# EasyEDA Pro project ProPrj_智能视觉集成板-V1.1.epro, board PCB1
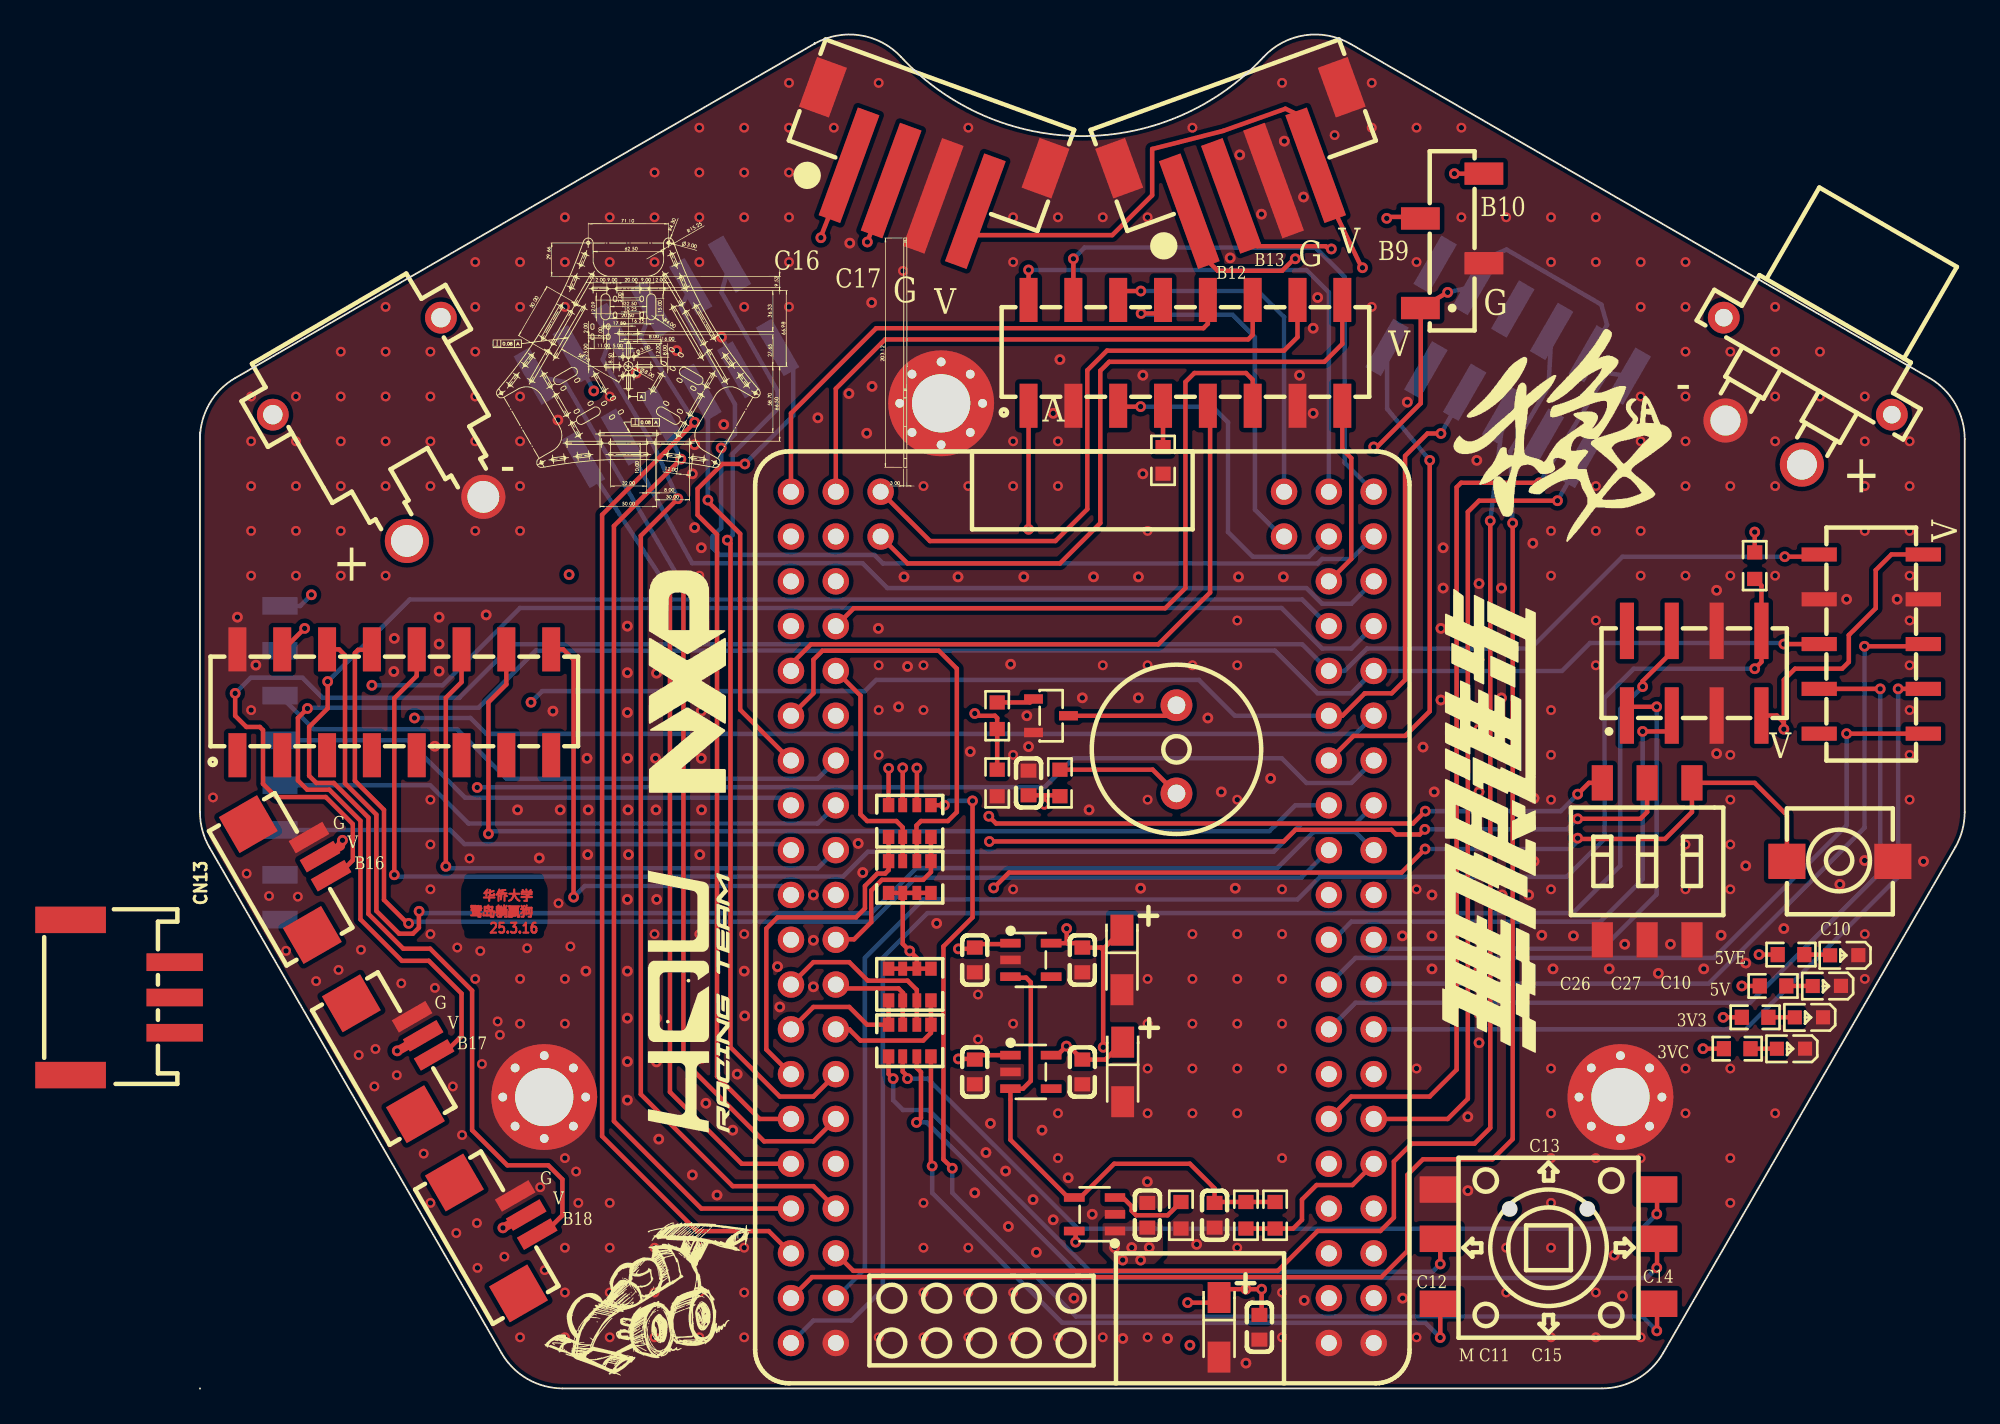
[diagram p11: board, top side]
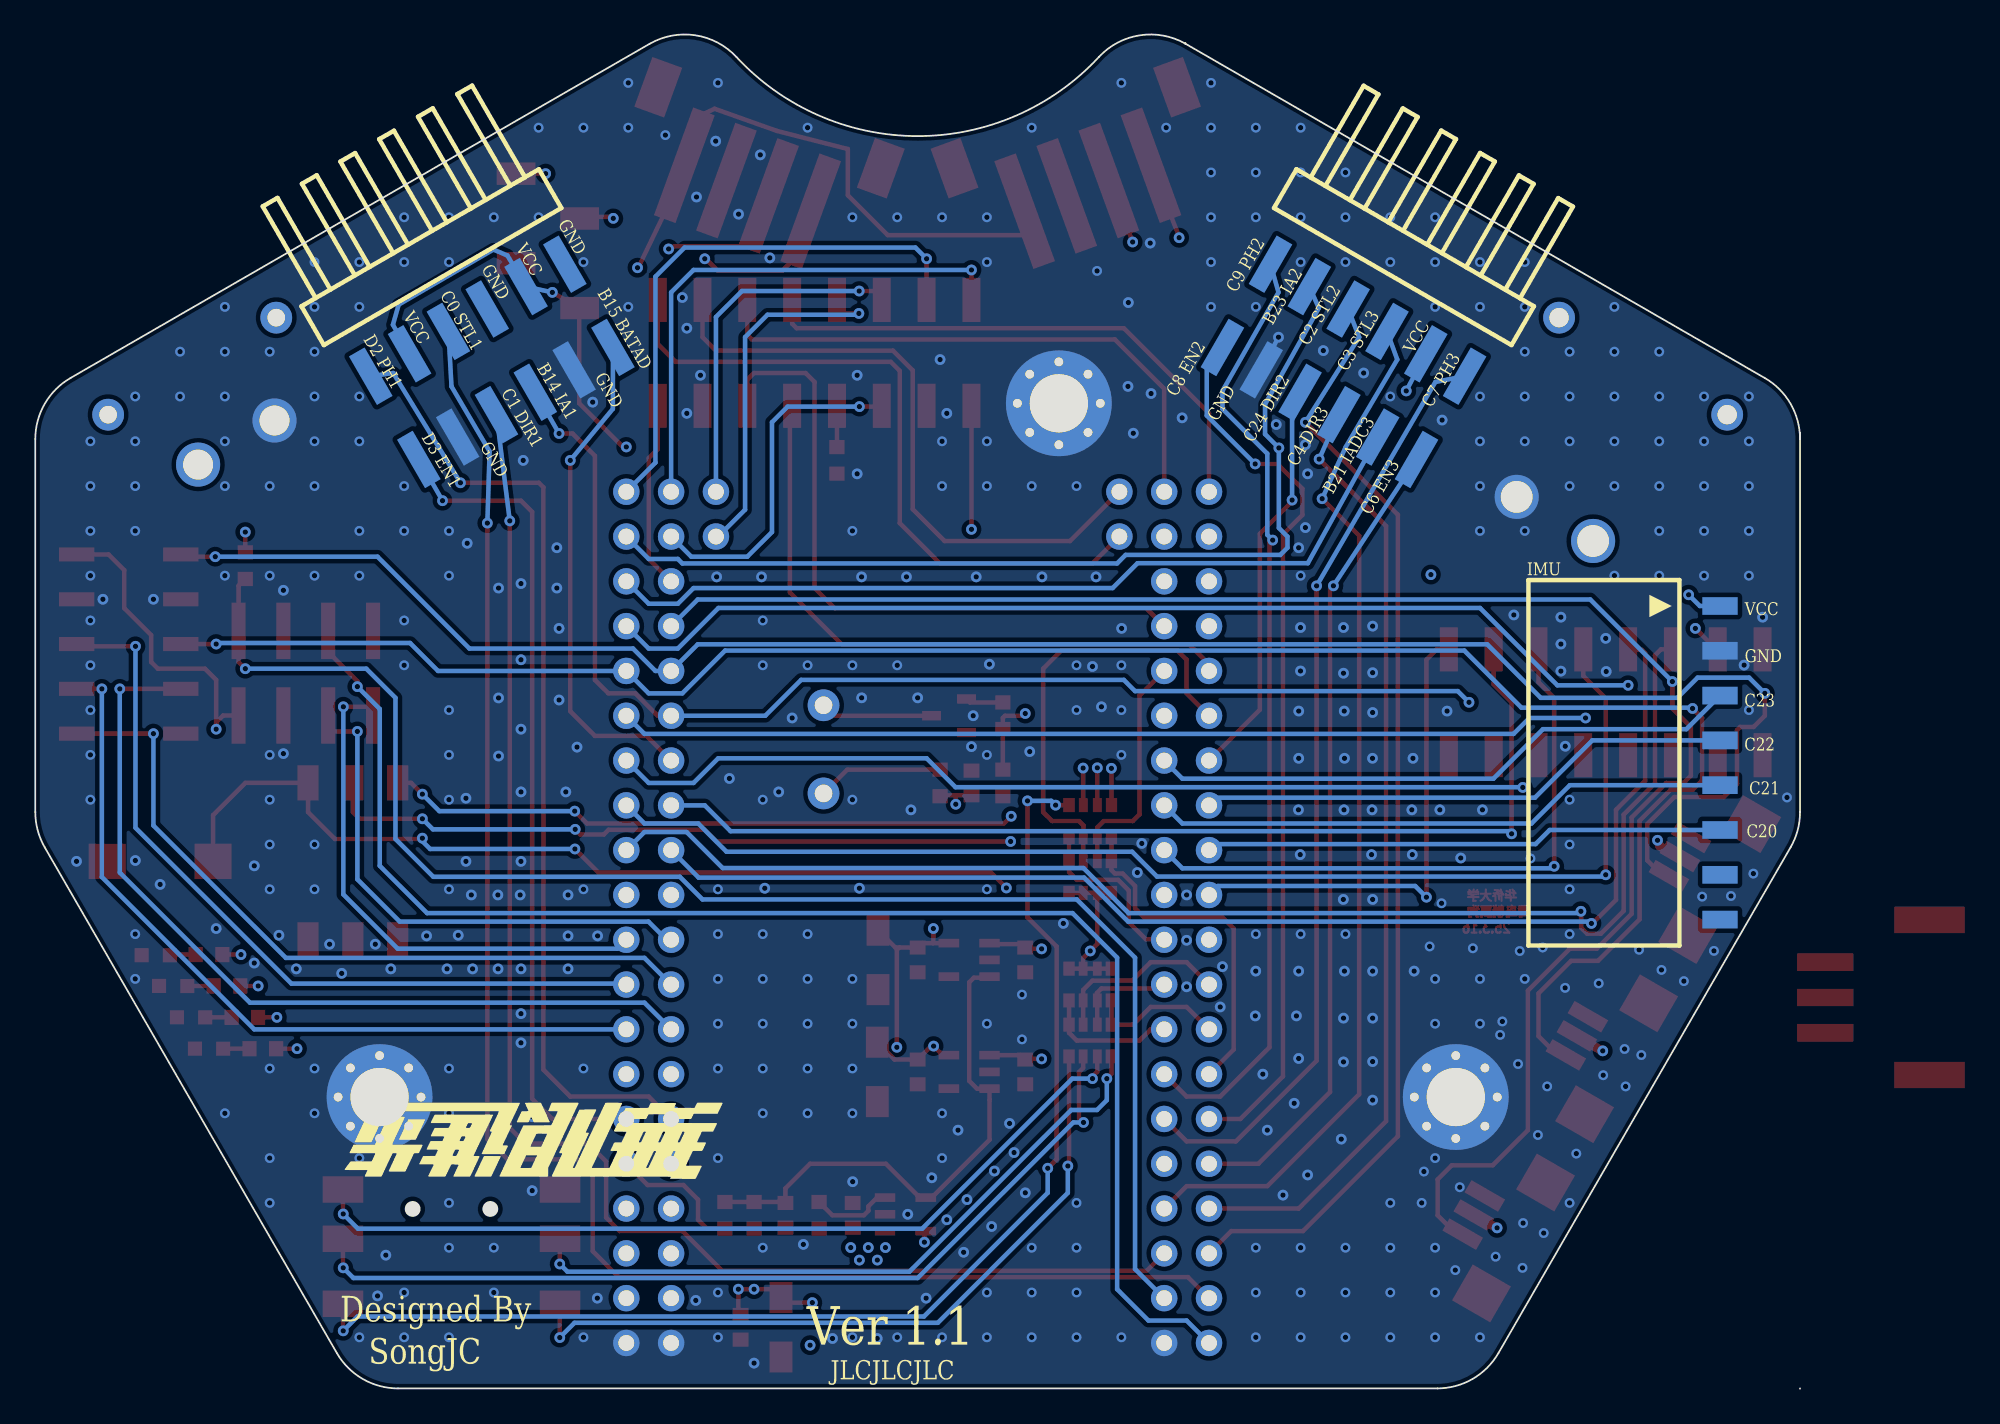
[diagram p12: board, bottom side, seen from below]

Outline 100 x 76.73 mm; copper layers: Top Layer, Inner1, Inner2, Bottom Layer. Coordinates in mm from the lower left corner of the outline.
Outline path: 0,54.21 0,53.84 arc(0.54,55.84) 2,57.3 34.84,76.27 arc(34.84,76.26) 34.82,76.25 arc(37.4,76.73) 39.73,75.5 arc(50,71.02) 60.27,75.5 arc(62.6,76.73) 65.2,76.24 98,57.3 arc(99.46,55.84) 100,53.84 100,32.69 arc(99.86,31.66) 99.46,30.69 82.91,2.02 arc(81.44,0.55) 79.44,0.02 20.56,0.02 arc(18.56,0.55) 17.09,2.02 0.54,30.69 arc(0.14,31.66) 0,32.69 0,54.02 ; 0,0.02 0,0 ; 34.83,76.3 arc(34.83,76.3) 34.83,76.3
Stack: Top Layer 0.035mm 外层铜厚1oz / Dielectric1 0.2104mm 7628 RC49% 8.6mil / Inner1 0.0152mm 内层铜厚 / Dielectric2 1.065mm 1.1mm H/HOZ Copper / Inner2 0.0152mm 内层铜厚 / Dielectric3 0.2104mm 7628 RC49% 8.6mil / Bottom Layer 0.035mm 外层铜厚1oz

## Design rules (mm)
template: 自定义配置
spacing copperThickness1oz (default): track to track 0.102, other pairs 0.152 to 0.3
spacing copperThickness2oz: track to track 0.203, other pairs 0.152 to 0.3
track width copperThickness1oz (default): min 0.127, default 0.254, max 2.54
track width copperThickness2oz: min 0.203, default 0.254, max 2.54
differential pair differentialPair (default): width min 0.127, default 0.254, max 2.54; gap min 0.152, default 0.152
via viaSize (default): diameter min 0.5, default 0.61, max 10; hole min 0.3, default 0.305, max 6.3
net GND_MAIN uses ZHILIAN
net VCC_5V_EXT uses ZHILIAN

## Placement (name value [footprint] x y rotation side)
BUZZER1  3kHz  [BUZ-TH_BD9.6-P5.00-D0.7-FD]  55.33 36.25 90 top
C1  1uF  [C0603]  60.03 3.48 90 top
C2  10uF  [CAP-SMD_L3.2-W1.6-RD-C7171]  57.75 3.48 270 top
C3  1uF  [C0603]  57.49 9.83 270 top
C4  100nF  [C0603]  43.9 17.96 90 top
C5  100nF  [C0603]  50 17.96 90 top
C6  10uF  [CAP-SMD_L3.2-W1.6-RD-C7171]  52.29 17.96 270 top
C7  100nF  [C0603]  43.9 24.31 90 top
C8  100nF  [C0603]  50 24.31 90 top
C9  10uF  [CAP-SMD_L3.2-W1.6-RD-C7171]  52.24 24.31 270 top
C10  100nF  [C0603]  53.68 9.83 270 top
C11  1uF  [C0603]  46.95 34.34 90 top
CN6  XT30PW-M30.G.Y  [CONN-TH_XT30PW-M]  11.39 53.64 210 top
CN10  HC-1.25-3PWT  [CONN-SMD_HC-1.25-3PWT]  5.68 29.52 300 top
CN11  HC-1.25-3PWT  [CONN-SMD_HC-1.25-3PWT]  11.52 19.36 300 top
CN12  HC-1.25-3PWT  [CONN-SMD_HC-1.25-3PWT]  17.36 9.2 300 top
CN13  PH-3AWT  [CONN-SMD_PH-3AWT]  -4.38 22.18 270 top
J1  -  [M3螺帽]  19.51 16.54 0 top
J3  -  [M3螺帽]  42 55.87 0 top
J4  -  [M3螺帽]  80.49 16.54 0 top
LED1  NCD0603R1  [LED0603-RD_RED]  93.17 24.58 180 top
LED2  NCD0603R1  [LED0603-RD_RED]  92.19 22.83 180 top
LED3  NCD0603R1  [LED0603-RD_RED]  91.17 21.06 180 top
LED4  NCD0603R1  [LED0603-RD_RED]  90.16 19.28 180 top
Q1  S8050  [SOT-23-3_L2.9-W1.3-P1.90-LS2.3-BR]  48.22 38.15 180 top
R1  10kΩ  [R0603]  60.92 9.83 90 top
R2  0Ω  [R0603]  59.27 9.83 90 top
R3  10kΩ  [R0603]  54.57 52.63 90 top
R4  10kΩ  [R0603]  89.14 22.83 180 top
R5  10kΩ  [R0603]  90.16 24.61 180 top
R6  4.7kΩ  [R0603]  88.12 21.06 180 top
R7  4.7kΩ  [R0603]  87.11 19.28 180 top
R8  4.7kΩ  [R0603]  55.59 9.83 90 top
R9  10kΩ  [R0603]  88.1 46.66 90 top
R10  4.7kΩ  [R0603]  45.17 38.15 270 top
R11  10kΩ  [R0603]  45.17 34.34 270 top
R12  10Ω  [R0603]  48.73 34.34 90 top
RN1  1kΩ  [RES-ARRAY-SMD_0603-8P-L3.2-W1.6-BL]  40.22 22.91 0 top
RN2  1kΩ  [RES-ARRAY-SMD_0603-8P-L3.2-W1.6-BL]  40.22 29.01 180 top
RN3  100Ω  [RES-ARRAY-SMD_0603-8P-L3.2-W1.6-BL]  40.22 32.19 180 top
RN4  100Ω  [RES-ARRAY-SMD_0603-8P-L3.2-W1.6-BL]  40.22 19.74 180 top
SW3  DSIC03LS-P  [SW-SMD_6P-L8.6-W6.2-P2.54-LS9.8]  82 29.9 0 top
SW5  K1-1504SA-06  [SW-SMD_K1-1504SA-06]  76.42 8.06 0 top
tof  X6511WVS-04H-C60D48R1  [HDR-SMD_4P-P2.54-V-M-S4.8]  70.96 65.08 90 top
U56  XT30PW-F20.G.Y  [CONN-TH_XT30PW-F-1]  89.86 55.81 150 top
U58  PZ254-2-06-WS  [HDR-SMD_12P-P2.54_HCTL_PZ254-2-06-WS]  25.87 58.22 30 bottom
U60  HX 2.54-4PIN LTJS  [CONN-SMD_4P-P2.54_HX-2.54-4PIN-LTJS]  59.02 69.78 200 top
U63  HX 2.54-4PIN LTJS  [CONN-SMD_4P-P2.54_HX-2.54-4PIN-LTJS]  40.98 69.78 160 top
U64  -  [MIMXRT1064xVL_CoreBoard - 3D]  50 26.72 90 top
U65  RT9013-33GB  [SOT-23-5_L3.0-W1.7-P0.95-LS2.8-BL]  47.08 17.96 270 top
U66  RT9013-33GB  [SOT-23-5_L3.0-W1.7-P0.95-LS2.8-BL]  47.08 24.31 270 top
U71  SY6280AAC  [SOT-23-5_L3.0-W1.7-P0.95-LS2.8-BL]  50.7 9.89 90 top
U72  SKPMAQE010  [KEY-SMD_2P-L6.0-W6.0-P6.00]  92.93 29.9 0 top
单驱连接  PZ254-2-06-WS  [HDR-SMD_12P-P2.54_HCTL_PZ254-2-06-WS]  74.13 58.22 330 bottom
屏幕  PM254-2-08-S-8.5  [HDR-SMD_16P-P2.54-V-F-R2-C8-LS7.1]  11.01 38.92 0 top
摄像头  PM254-2-08-S-8.5  [HDR-SMD_16P-P2.54-V-F-R2-C8-LS7.1]  55.84 58.73 0 top
无线串口  PM254-2-04-S-8.5  [HDR-SMD_8P-P2.54-V-F-R2-C4-S7.1]  84.67 40.57 0 top
虚线串口spi  PM254-2-05-S-8.5  [HDR-SMD_10P-P2.54-V-F-R2-C5-LS7.1-1]  94.7 42.22 270 top
陀螺仪  X6511FRS-08-C85D30  [HDR-SMD_8P-P2.54-H-F-L11.5]  4.53 35.49 270 bottom

## Footprints (pads in the part's own frame, mm; a bottom-side part is the same pattern mirrored in y, then rotated)
BUZ-TH_BD9.6-P5.00-D0.7-FD
  round 1.8 hole 1: 1(-2.5,0) 2(2.5,0)
C0603
  rect 0.8x0.9 smd: 1(-0.7,0) 2(0.7,0)
CAP-SMD_L3.2-W1.6-RD-C7171
  rect 1.758x1.296 smd: 1(-1.687,0) 2(1.687,0)
CONN-SMD_4P-P2.54_HX-2.54-4PIN-LTJS
  rect 1.3x6.5 smd: 1(3.81,1.825) 2(1.27,1.825) 3(-1.27,1.825) 4(-3.81,1.825)
  rect 1.8x3 smd: 5(-6.71,-1.825) 6(6.71,-1.825)
CONN-SMD_HC-1.25-3PWT
  rect 0.8x2.2 smd: 1(-1.25,1.3) 2(0,1.3) 3(1.25,1.3)
  rect 2.35x2.5 smd: 4(-3.63,-1.3) 5(3.63,-1.3)
CONN-SMD_PH-3AWT
  rect 1x3.2 smd: 1(-2,2.95) 2(0,2.95) 3(2,2.95)
  rect 1.5x4 smd: 4(4.4,-2.95) 5(-4.4,-2.95)
CONN-TH_XT30PW-F-1
  round 2.5 hole 1.7: 1(-2.5,2.5) 2(2.5,2.5)
  round 1.8 hole 1: 3(5.5,-2.5) 4(-5.5,-2.5)
CONN-TH_XT30PW-M
  round 2.5 hole 1.8: 1(-2.5,5) 2(2.5,5)
  round 1.8 hole 1.1: 3(5.5,-5) 4(-5.5,-5)
HDR-SMD_4P-P2.54-V-M-S4.8
  rect 1.27x2.2 smd: 1(-3.81,1.8) 2(-1.27,-1.8) 3(1.27,1.8) 4(3.81,-1.8)
HDR-SMD_8P-P2.54-H-F-L11.5
  rect 1x2 smd: 1(-8.89,0) 2(-6.35,0) 3(-3.81,0) 4(-1.27,0) 5(1.27,0) 6(3.81,0) 7(6.35,0) 8(8.89,0)
HDR-SMD_8P-P2.54-V-F-R2-C4-S7.1
  rect 0.8x3.2 smd: 1(-3.81,-2.4) 2(-3.81,2.4) 3(-1.27,-2.4) 4(-1.27,2.4) 5(1.27,-2.4) 6(1.27,2.4) 7(3.81,-2.4) 8(3.81,2.4)
HDR-SMD_10P-P2.54-V-F-R2-C5-LS7.1-1
  rect 0.8x2 smd: 1(-5.08,-2.95) 2(-2.54,-2.95) 3(0,-2.95) 4(2.54,-2.95) 5(5.08,-2.95) 6(5.08,2.95) 7(2.54,2.95) 8(0,2.95) 9(-2.54,2.95) 10(-5.08,2.95)
HDR-SMD_12P-P2.54_HCTL_PZ254-2-06-WS
  rect 1.02x3.17 smd: 1(-6.35,-2.725) 2(-6.35,2.725) 3(-3.81,-2.725) 4(-3.81,2.725) 5(-1.27,-2.725) 6(-1.27,2.725) 7(1.27,-2.725) 8(1.27,2.725) 9(3.81,-2.725) 10(3.81,2.725) 11(6.35,-2.725) 12(6.35,2.725)
HDR-SMD_16P-P2.54-V-F-R2-C8-LS7.1
  rect 1.02x2.5 smd: 1(-8.89,-3) 2(-8.89,3) 3(-6.35,-3) 4(-6.35,3) 5(-3.81,-3) 6(-3.81,3) 7(-1.27,-3) 8(-1.27,3) 9(1.27,-3) 10(1.27,3) 11(3.81,-3) 12(3.81,3) 13(6.35,-3) 14(6.35,3) 15(8.89,-3) 16(8.89,3)
KEY-SMD_2P-L6.0-W6.0-P6.00
  rect 2.1x2 smd: 1(-3,0) 2(3,0)
LED0603-RD_RED
  rect 0.8x0.8 smd: 1(-0.799,-0.004) 2(0.799,0.004)
M3螺帽
  round 6 hole 3.302: 1(0,0)
  round 1 hole 0.5: 2(0,2.349) 3(0,-2.349) 4(2.349,0) 5(-2.349,0) 6(1.651,1.651) 7(-1.651,-1.651) 8(1.651,-1.651) 9(-1.651,1.651)
MIMXRT1064xVL_CoreBoard - 3D
  round 1.5 hole 0.9: 1(-24.13,-16.51) 2(-24.13,-13.97) 3(-21.59,-16.51) 4(-21.59,-13.97) 5(-19.05,-16.51) 6(-19.05,-13.97) 7(-16.51,-16.51) 8(-16.51,-13.97) 9(-13.97,-16.51) 10(-13.97,-13.97) 11(-11.43,-16.51) 12(-11.43,-13.97) 13(-8.89,-16.51) 14(-8.89,-13.97) 15(-6.35,-16.51) 16(-6.35,-13.97) 17(-3.81,-16.51) 18(-3.81,-13.97) 19(-1.27,-16.51) 20(-1.27,-13.97) 21(1.27,-16.51) 22(1.27,-13.97) 23(3.81,-16.51) 24(3.81,-13.97) 25(6.35,-16.51) 26(6.35,-13.97) 27(8.89,-16.51) 28(8.89,-13.97) 29(11.43,-16.51) 30(11.43,-13.97) 31(13.97,-16.51) 32(13.97,-13.97) 33(16.51,-16.51) 34(16.51,-13.97) 35(19.05,-16.51) 36(19.05,-13.97) 37(21.59,-16.51) 38(21.59,-13.97) 39(24.13,-16.51) 40(24.13,-13.97) 41(21.59,-11.43) 42(24.13,-11.43) 43(24.13,11.43) 44(21.59,11.43) 45(24.13,13.97) 46(24.13,16.51) 47(21.59,13.97) 48(21.59,16.51) 49(19.05,13.97) 50(19.05,16.51) 51(16.51,13.97) 52(16.51,16.51) 53(13.97,13.97) 54(13.97,16.51) 55(11.43,13.97) 56(11.43,16.51) 57(8.89,13.97) 58(8.89,16.51) 59(6.35,13.97) 60(6.35,16.51) 61(3.81,13.97) 62(3.81,16.51) 63(1.27,13.97) 64(1.27,16.51) 65(-1.27,13.97) 66(-1.27,16.51) 67(-3.81,13.97) 68(-3.81,16.51) 69(-6.35,13.97) 70(-6.35,16.51) 71(-8.89,13.97) 72(-8.89,16.51) 73(-11.43,13.97) 74(-11.43,16.51) 75(-13.97,13.97) 76(-13.97,16.51) 77(-16.51,13.97) 78(-16.51,16.51) 79(-19.05,13.97) 80(-19.05,16.51) 81(-21.59,13.97) 82(-21.59,16.51) 83(-24.13,13.97) 84(-24.13,16.51)
R0603
  rect 0.806x0.864 smd: 1(-0.753,0) 2(0.753,0)
RES-ARRAY-SMD_0603-8P-L3.2-W1.6-BL
  rect 0.65x0.8 smd: 1(-1.2,-0.9) 4(1.2,-0.9) 5(1.2,0.9) 8(-1.2,0.9)
  rect 0.5x0.8 smd: 2(-0.4,-0.9) 3(0.4,-0.9) 6(0.4,0.9) 7(-0.4,0.9)
SOT-23-3_L2.9-W1.3-P1.90-LS2.3-BR
  rect 1.07x0.532 smd: 1(0.99,-0.95) 2(0.99,0.95) 3(-0.99,0)
SOT-23-5_L3.0-W1.7-P0.95-LS2.8-BL
  rect 0.49x1.157 smd: 1(-0.95,-1.153) 2(0,-1.153) 3(0.95,-1.153)
  rect 0.49x1.175 smd: 4(0.95,1.153) 5(-0.95,1.153)
SW-SMD_6P-L8.6-W6.2-P2.54-LS9.8
  rect 1.2x2 smd: 1(-2.54,-4.45) 2(0,-4.45) 3(2.54,-4.45) 4(2.54,4.45) 5(0,4.45) 6(-2.54,4.45)
SW-SMD_K1-1504SA-06
  rect 2.3x1.5 smd: 1(-6.15,3.239) 2(-6.15,0.445) 3(-6.15,-3.239) 4(6.15,3.239) 5(6.15,0.445) 6(6.15,-3.239)

## Nets
As in the schematic, except:
GND_MAIN: C1.1 C2.2 C3.2 C4.1 C5.1 C6.2 C7.1 C8.1 C9.2 C10.1 C11.2 CN6.1 CN10.1 CN11.1 CN12.1 J1.1 J1.2 J1.3 J1.4 J1.5 J1.6 J1.7 J1.8 J1.9 J3.1 J3.2 J3.3 J3.4 J3.5 J3.6 J3.7 J3.8 J3.9 J4.1 J4.2 J4.3 J4.4 J4.5 J4.6 J4.7 J4.8 J4.9 LED1.1 LED2.1 LED3.1 LED4.1 Q1.2 R3.1 R8.1 R11.2 SW3.1 SW3.2 SW3.3 SW5.1 tof.2 U56.2 U58.10 U60.3 U60.5 U60.6 U63.3 U63.5 U63.6 U64.1 U64.2 U64.83 U65.2 U66.2 U71.2 U72.2 单驱连接.4 单驱连接.10 屏幕.2 摄像头.3 摄像头.13 无线串口.5 无线串口.6 虚线串口spi.2 虚线串口spi.9 陀螺仪.2

Pads without a net: CN6 3 4; CN10 4 5; CN11 4 5; CN12 4 5; CN13 1 2 3 4 5; U56 3 4; U64 3 4 7 8 21 22; U65 4; U66 4; 单驱连接 5; 屏幕 1 3 5 7 9 11 13 15; 无线串口 2; 虚线串口spi 5; 陀螺仪 7 8

## Via types
v1: diameter 0.61, hole 0.305, Top Layer to Bottom Layer, 293 vias
v2: diameter 0.559, hole 0.305, Top Layer to Bottom Layer, 291 vias

## Routing (per net, layer and track width the routed paths; a pad name or vN(x,y) marks a point on that pad's centre or on a via; arc(x,y) is an arc through that point)
GND_MAIN: length 2.1
  Bottom Layer w0.254: v1(29.55,59.62) U58.10
  vias: v1(2.12,43.74) v1(3.17,41.02) v1(11.01,42.54) v1(10.98,40.66) v1(13.3,36.43) v1(13.55,43.74) v1(13.55,42.22) v1(13.55,40.68) v1(16.22,43.87) v1(18,32.82) v1(19.23,30.09) v1(20,38.42) v1(20.28,54.92) v1(20.41,32.82) v1(21.93,35.74) v1(21.87,23.68) v1(22,32.82) v1(21.97,30.28) v1(24.22,43.23) v1(24.22,40.6) v1(24.22,38.34) v1(24.23,35.74) v1(24.22,27.74) v1(24.22,23.68) v1(24.22,21.01) v1(24.22,18.55) v1(24.22,16.36) v1(24.25,32.82) v1(24.28,30.28) v1(24.73,57.59) v1(25.83,38.42) v1(25.81,35.74) v1(25.84,32.82) v1(25.82,23.68) v1(25.87,43.16) v1(25.87,40.57) v1(25.88,27.74) v1(25.87,21.01) v1(25.87,18.53) v1(26,14.15) v1(27.01,58.86) v1(27.9,51.87) v1(27.9,12.12) v1(28.03,53.52) v1(28.03,48.82) v1(28.31,43.16) v1(28.31,40.69) v1(28.32,30.28) v1(28.41,47.68) v1(28.41,38.42) v1(28.41,35.74) v1(28.42,32.82) v1(28.41,23.68) v1(28.41,18.72) v1(28.54,21.14) v1(28.66,16.18) v1(29.3,10.98) v1(29.68,54.66) v1(30.19,14.66) v1(30.44,17.83) v1(30.84,23.68) v1(30.87,21.14) v1(32.73,23.93) v1(32.85,21.64) v1(34.76,27.99) v1(34.76,25.42) v1(34.76,22.79) v1(35.01,55.05) v1(36.82,64.95) v1(36.77,56.42) v1(37.3,30.92) v1(37.55,29.26) v1(37.78,54.17) v1(38.06,61.58) v1(38.08,56.83) v1(38.44,43.11) v1(39.59,38.66) v1(39.89,46.03) v1(40.09,40.95) v1(41.75,26.38) v1(42.96,46.03) v1(43.65,36.12) v1(43.9,11.11) v1(44.54,13.39) v1(44.79,15.04) v1(45.65,12.34) v1(45.81,9.2) v1(45.94,41.08) v1(46.68,46.03) v1(46.85,38.15) v1(46.95,36.4) v1(47.21,10.72) v1(47.39,7.74) v1(47.71,14.66) v1(48.35,55.3) v1(48.35,9.58) v1(48.73,58.35) v1(49.2,11.96) v1(49.52,5.13) v1(50,39.17) v1(50.38,32.82) v1(50.63,46.03) v1(50.56,9.89) v1(52.29,2.85) v1(53.18,46.03) v1(53.18,39.17) v1(53.3,28.38) v1(53.43,57.46) v1(53.43,51.87) v1(53.68,11.74) v1(54.83,2.85) v1(56.48,8.18) v1(57.11,38.03) v1(57.87,33.84) v1(58.38,64.11) v1(58.66,28.38) v1(58.85,46.03) v1(58.92,69.95) v1(59.27,1.45) v1(60.15,66.59) v1(60.67,34.6) v1(61.44,70.73) v1(61.39,46.03) v1(62.31,57.46) v1(62.53,67.56) v1(62.57,5.01) v1(63.08,60.13) v1(63.08,55.3) v1(63.34,61.87) v1(68.14,25.67) v1(68.15,5.13) v1(68.41,55.93) v1(69.3,36.38) v1(69.81,27.99) v1(69.81,25.67) v1(69.81,23.8) v1(69.94,33.84) v1(70.32,43.11) v1(70.32,39.05) v1(70.45,47.68) v1(70.45,45.39) v1(71.84,15.42) v1(71.84,11.23) v1(72.35,52.63) v1(72.48,45.65) v1(72.48,41.33) v1(72.48,37.39) v1(72.48,33.84) v1(72.48,29.9) v1(72.53,27.99) v1(72.48,23.8) v1(72.48,21.26) v1(72.48,19.61) v1(73.75,45.39) v1(73.75,39.16) v1(73.75,35.87) v1(73.79,27.99) v1(73.78,23.8) v1(75.22,23.8) v1(75.29,27.99) v1(75.53,47.93) v1(75.6,33.48) v1(75.6,29.9) v1(76.03,25.71) v1(76.67,23.8) v1(77.83,25.67) v1(79.86,23.8) v1(80.14,7.57) v1(80.61,5.26) v1(80.73,25.2) v1(82.64,23.55) v1(83.33,25.2) v1(85.21,23.8) v1(85.94,45.27) v1(85.94,36.01) v1(86.19,25.71) v1(87.59,29.65) v1(87.59,24.13) v1(89.75,26.09) v1(92.93,28.59) v1(93.31,44.76) v1(94.33,29.95) v1(96.17,44.76) v1(97.66,29.9) v2(0.74,33.52) v2(2.64,29.2) v2(2.9,56.26) v2(2.9,53.72) v2(2.9,51.18) v2(2.9,48.64) v2(2.9,46.1) v2(2.9,38.48) v2(3.91,27.93) v2(4.88,24.82) v2(5.44,56.26) v2(5.44,53.72) v2(5.44,51.18) v2(5.44,48.64) v2(5.44,46.1) v2(5.55,27.9) v2(6.58,23.11) v2(7.85,23.74) v2(7.98,58.8) v2(7.98,56.26) v2(7.98,53.72) v2(7.98,51.18) v2(7.98,48.64) v2(7.98,46.1) v2(8.99,18.92) v2(9.12,24.89) v2(9.94,19.26) v2(9.88,17.14) v2(10.52,61.34) v2(10.52,58.8) v2(10.52,56.26) v2(10.52,53.72) v2(10.52,51.18) v2(10.52,46.1) v2(11.15,17.77) v2(11.41,22.98) v2(12.68,13.33) v2(13.06,58.8) v2(13.06,56.26) v2(13.06,53.72) v2(13.06,51.18) v2(13.06,33.4) v2(13.06,30.86) v2(13.06,28.32) v2(13.06,25.78) v2(13.06,10.54) v2(13.31,22.73) v2(14.33,17.14) v2(14.53,8.83) v2(14.58,25.01) v2(14.85,14.38) v2(15.27,30.06) v2(15.6,63.88) v2(15.6,61.34) v2(15.6,58.8) v2(15.6,56.26) v2(15.6,53.72) v2(15.6,48.64) v2(15.6,23.24) v2(15.69,9.39) v2(15.72,6.85) v2(15.88,24.82) v2(15.98,18.41) v2(16.87,20.82) v2(17,20.06) v2(17.25,7.49) v2(18.14,63.88) v2(18.14,61.34) v2(18.14,56.26) v2(18.14,53.72) v2(18.14,51.18) v2(18.14,48.64) v2(18.14,23.24) v2(18.14,20.7) v2(18.14,2.92) v2(18.54,24.97) v2(19.28,11.42) v2(19.53,6.73) v2(20.32,27.52) v2(20.68,66.42) v2(20.68,63.88) v2(20.68,61.34) v2(20.68,23.24) v2(20.68,20.7) v2(20.68,13.08) v2(20.68,8) v2(20.68,5.46) v2(20.68,2.92) v2(20.99,25.08) v2(21.31,12.31) v2(21.44,10.54) v2(23.22,66.42) v2(23.22,63.88) v2(23.22,56.26) v2(23.22,10.54) v2(23.22,8) v2(23.22,5.46) v2(23.22,2.92) v2(25.76,68.96) v2(25.76,66.42) v2(25.76,63.88) v2(25.76,25.78) v2(25.76,8) v2(25.76,5.46) v2(25.76,2.92) v2(28.3,71.5) v2(28.3,68.96) v2(28.3,66.42) v2(28.3,63.88) v2(28.3,46.1) v2(28.3,25.78) v2(28.3,8) v2(28.3,5.46) v2(28.3,2.92) v2(30.84,71.5) v2(30.84,68.96) v2(30.84,66.42) v2(30.84,61.34) v2(30.84,25.78) v2(30.84,8) v2(30.84,5.46) v2(30.84,2.92) v2(33.38,74.04) v2(33.38,71.5) v2(33.38,68.96) v2(33.38,66.42) v2(33.38,63.88) v2(33.38,61.34) v2(35.92,71.5) v2(38.46,74.04) v2(38.46,41.02) v2(38.46,38.48) v2(38.46,35.94) v2(38.46,2.92) v2(39.83,63.37) v2(41,51.18) v2(41,41.02) v2(41,38.48) v2(41,10.54) v2(41,8) v2(41,5.46) v2(41,2.92) v2(43.54,71.5) v2(43.54,51.18) v2(43.54,8) v2(43.54,5.46) v2(43.54,2.92) v2(44.09,22.35) v2(44.09,19.81) v2(46.08,66.42) v2(46.08,63.88) v2(46.08,53.72) v2(46.08,51.18) v2(46.08,35.94) v2(46.08,28.32) v2(46.08,20.7) v2(46.08,5.46) v2(46.08,2.92) v2(48.62,66.42) v2(48.62,53.72) v2(48.62,51.18) v2(48.62,15.62) v2(48.62,13.08) v2(48.62,2.92) v2(51.16,66.42) v2(51.16,41.02) v2(51.16,2.92) v2(53.7,66.42) v2(53.7,48.64) v2(53.7,41.02) v2(53.7,33.4) v2(53.7,23.24) v2(53.7,20.7) v2(53.7,18.16) v2(53.7,15.62) v2(53.7,2.92) v2(56.24,71.5) v2(56.24,41.02) v2(56.24,25.78) v2(56.24,23.24) v2(56.24,20.7) v2(56.24,18.16) v2(56.24,15.62) v2(58.78,43.56) v2(58.78,41.02) v2(58.78,33.4) v2(58.78,25.78) v2(58.78,23.24) v2(58.78,20.7) v2(58.78,18.16) v2(58.78,15.62) v2(58.78,8) v2(61.32,74.04) v2(61.32,28.32) v2(61.32,25.78) v2(61.32,23.24) v2(61.32,20.7) v2(61.32,18.16) v2(61.32,13.08) v2(61.32,5.46) v2(61.32,2.92) v2(64.29,71.07) v2(66.4,74.04) v2(66.4,71.5) v2(66.4,61.34) v2(68.94,71.5) v2(68.94,63.88) v2(68.94,28.32) v2(68.94,18.16) v2(68.94,2.92) v2(71.48,71.5) v2(71.48,66.42) v2(74.02,66.42) v2(74.02,8) v2(74.02,5.46) v2(76.56,66.42) v2(76.56,63.88) v2(76.56,48.64) v2(76.56,46.1) v2(76.56,38.48) v2(76.56,35.94) v2(76.56,33.4) v2(76.56,28.32) v2(76.56,18.16) v2(76.56,15.62) v2(76.56,13.08) v2(76.56,10.54) v2(76.56,8) v2(76.56,2.92) v2(79.1,66.42) v2(79.1,63.88) v2(79.1,51.18) v2(79.1,48.64) v2(79.1,43.56) v2(79.1,41.02) v2(79.1,13.08) v2(79.1,5.46) v2(79.1,2.92) v2(81.64,63.88) v2(81.64,61.34) v2(81.64,56.26) v2(81.64,53.72) v2(81.64,48.64) v2(81.64,46.1) v2(81.64,13.08) v2(81.64,2.92) v2(84.18,63.88) v2(84.18,61.34) v2(84.18,58.8) v2(84.18,56.26) v2(84.18,53.72) v2(84.18,51.18) v2(84.18,46.1) v2(84.18,30.86) v2(84.18,28.32) v2(84.18,18.16) v2(84.18,15.62) v2(86.72,58.8) v2(86.72,51.18) v2(86.72,46.1) v2(86.72,35.94) v2(86.72,33.4) v2(86.72,30.86) v2(86.72,28.32) v2(86.72,18.16) v2(86.72,13.08) v2(86.72,10.54) v2(89.26,61.34) v2(89.26,58.8) v2(89.26,56.26) v2(89.26,53.72) v2(89.26,51.18) v2(89.26,46.1) v2(89.26,15.62) v2(91.8,58.8) v2(91.8,56.26) v2(94.34,56.26) v2(94.34,53.72) v2(94.34,51.18) v2(94.34,48.64) v2(94.34,25.78) v2(94.34,23.24) v2(96.88,53.72) v2(96.88,51.18) v2(96.88,48.64) v2(96.88,46.1) v2(96.88,43.56) v2(96.88,41.02) v2(96.88,38.48) v2(96.88,35.94) v2(96.88,33.4)
VCC_3V3: length 287.5
  Top Layer w0.254: v1(47.84,33.14) 47.84,33.6 47.79,33.64 ; U65.5 48.58,18.91 v1(49.1,19.42) 49.24,19.42 C5.2 51.31,18.66 51.76,19.12 51.76,19.13 C6.1 ; 屏幕.4 4.74,41.92 v1(5.93,43.11) ; 40.62,23.81 40.62,24.42 v1(40.22,24.82) 39.82,25.22 RN2.6 ; 40.62,23.81 41.42,23.81 ; 40.62,23.81 39.02,23.81 ; R12.1 48.68,33.64 47.79,33.64 ; RN2.6 RN2.7 RN2.8 ; RN2.6 39.02,28.11 ; 47.79,33.64 C11.1 ; v1(70.7,62.16) tof.1 69.18,61.25 69.18,55.87 66.7,53.39 v1(66.51,53.39) ; v1(86.31,21.06) R6.2 ; v1(88.1,48.57) R9.2
  Top Layer w0.508: 11.18,19.14 12.43,19.83 ; 7.96,30.76 7.45,30.48 ; 17.25,9.15 18.51,9.87 ; 8.04,31.08 7.97,30.82
  Inner2 w0.254: v1(20.92,46.16) 20.92,55.17 v1(22.31,56.57) ; v1(20.92,46.16) 12.86,46.16 11.73,45.02 ; v1(20.92,46.16) 23.33,43.74 23.33,32.19 30.7,24.82 32.67,24.82 33.06,24.43 36.46,24.43 36.85,24.82 v1(40.22,24.82) 40.98,25.58 43.52,25.58 49.1,20.01 ; 11.73,45.02 CN6.2 ; 11.73,45.02 11.72,45.01 v1(6.31,45.01) 6.31,43.49 v1(5.93,43.11) ; 11.18,19.07 11.18,19.33 9.68,20.84 9.68,29.57 8.09,31.16 ; 8.06,31.16 4.98,34.23 4.98,39.19 5.92,40.13 5.92,43.06 ; v1(47.84,33.14) 47.84,23.68 49.1,22.42 49.1,20.01 ; 49.1,19.98 49.1,20.01 ; 49.1,19.98 v1(49.1,19.42) ; 49.1,19.98 51.65,22.53 51.65,34.73 53.3,36.38 59.53,36.38 62.57,39.42 66.89,39.42 67.68,40.21 67.68,52.23 v1(66.51,53.39) ; 11.17,19.26 11.11,19.2 ; v1(70.7,62.16) 84.29,48.57 v1(88.1,48.57) 89.62,48.57 90.51,47.68 90.51,25.2 88.86,23.55 86.7,23.55 86.31,23.16 v1(86.31,21.06) ; 11.21,19.22 17.12,9.17
  Bottom Layer w0.254: v1(70.7,62.16) 72.19,62.49 73.25,64.25 74.04,64.59 79.41,61.46 79.74,60.32 单驱连接.9 ; v1(6.31,45.01) 5.68,44.38 陀螺仪.1 ; v1(22.31,56.57) U58.3
  vias: v1(8.08,31.09) v1(11.18,19.16) v1(17.17,9.12)
VCC_5V: length 147.7
  Top Layer w0.254: v1(87.37,22.83) R4.2 ; U65.1 44.15,18.91 C4.2 43.87,18.7 v1(42.98,18.7) ; U71.5 49.62,8.86 v1(49.62,8.31) ; 45.91,25.21 44.14,25.21 43.87,24.94 v1(42.98,24.94) ; C1.2 60.16,4.31 v1(60.16,5.64) v1(59.27,5.64) 58.22,5.64 C2.1 57.46,4.88 v1(55.97,4.88)
  Inner2 w0.254: v1(87.37,22.83) 91.64,22.83 91.66,22.85
  Inner2 w0.508: 48.72,7.42 51.25,4.88 v1(55.97,4.88) ; 48.72,7.42 48.72,7.42 v1(49.62,8.31) ; 48.72,7.42 42.98,13.16 v1(42.98,18.7) v1(42.98,24.94)
  Inner2 w0.635: U64.5 U64.6 62.19,7.67 v1(60.16,5.64) ; v1(56.1,2.47) 59.4,2.47 60.54,1.32 69.94,1.32 72.48,3.86 56.86,3.86 55.97,4.75 v1(55.97,4.88)
  Inner2 w1.27: 72.48,3.86 74.51,3.86 91.66,21.01 91.66,51.51 U56.1
VCC_5V_EXT: length 172.2
  Top Layer w0.254: v1(89.75,37.39) 89.75,37.77 ; 89.75,37.77 89.75,40.19 90.39,40.82 93.05,40.82 93.43,41.2 93.43,42.73 94.96,44.25 94.96,46.41 95.85,47.3 虚线串口spi.10 ; 89.75,37.77 89.36,38.17 无线串口.7 ; 53.96,70.29 53.96,67.66 51.7,65.4 43.46,65.4 ; 53.97,70.29 57.97,71.31 61.51,72.57 62.19,72.25 62.6,71.09 ; 65.81,63.6 63.68,68.04 ; v1(88.34,24.61) R5.2
  Inner2 w0.254: v1(88.34,24.61) 88.34,26.73 87.72,27.36
  Inner2 w0.508: v1(89.75,37.39) 89.75,29.39 87.72,27.36 81.62,27.36 70.83,16.56 62.35,16.56 v1(53.79,8) ; v1(52.8,8) 52.8,25.2 61.94,34.34 68.54,34.34 71.21,37.01 71.21,58.22 v1(65.88,63.55)
  vias: v1(51.83,8) v1(52.29,7.29) v1(53.3,7.29)
VCC_CSI_3V3: length 97.1
  Top Layer w0.254: 51.04,25.01 51.26,25.01 C9.1 ; 51.04,25.01 C8.2 49.75,25.26 49.13,25.26 ; 51.04,25.01 51.18,24.87 v1(51.18,19.36) ; U66.5 49.13,25.26 ; 49.13,25.26 49.11,25.28 v1(49.11,26.09) ; v1(85.17,19.28) 86.35,19.28 ; v1(46.95,48.72) 摄像头.1
  Inner2 w0.254: v1(46.95,48.72) 46.95,47.68 49.11,45.52 v1(49.11,26.09) ; v1(51.18,19.36) 50.13,18.3 50.13,10.28 49.98,10.13 49.98,9.65 50.13,9.5 50.13,9.33 50.51,8.94 50.51,7.55 51.78,6.28 53.05,6.28 53.3,6.02 55.97,6.02 61.43,11.48 68.8,11.48 77.81,20.5 83.95,20.5 v1(85.17,19.28)
B0: length 76.9
  Top Layer w0.254: v1(12.42,27.07) 12.41,27.06 12.41,26.14 12.06,25.8 11.28,25.8 10,27.09 10,32.55 8.22,34.33 8.22,41.58 7.88,41.92 屏幕.6
  Bottom Layer w0.254: v1(12.42,27.07) 12.52,26.97 38.05,26.97 40.6,29.52 61.05,29.52 63.09,31.56 65.48,31.56 U64.23
B1: length 71.5
  Top Layer w0.254: v1(11.82,26.38) 11.76,26.38 10.43,27.71 10.43,32.82 8.78,34.47 8.78,41.71 8.96,41.89 9.71,41.89 屏幕.8
  Bottom Layer w0.254: v1(11.82,26.38) 11.92,26.48 38.07,26.48 40.57,28.98 62.41,28.98 U64.24
B2: length 70.5
  Top Layer w0.254: v1(11.01,29.14) 11.01,39.14 12.28,40.41 屏幕.10
  Bottom Layer w0.254: v1(11.01,29.14) 11.11,29.04 36.44,29.04 37.84,30.44 60.83,30.44 62.43,32.05 65.48,32.05 U64.25
B3: length 59.2
  Top Layer w0.254: v1(16.34,31.46) 16.34,38.92 17.36,39.93 屏幕.14
  Bottom Layer w0.254: U64.26 62.06,33.07 60.6,31.61 16.49,31.61 v1(16.34,31.46)
B9: length 52
  Top Layer w0.254: tof.3 69.07,66.44 67.31,66.44
  Inner2 w0.254: v1(67.25,66.36) 66.79,65.89 62.75,65.89 61.06,64.2 61.06,52.64 57.89,49.47 35.41,49.47 34.76,48.82 34.76,47.04 U64.49
B10: length 54.1
  Top Layer w0.254: v1(71.08,68.89) tof.4
  Inner2 w0.254: U64.48 35,49.83 56.5,49.83 60.31,53.64 60.31,64.34 64.86,68.89 v1(71.08,68.89)
B11: length 17.6
  Top Layer w0.254: R11.1 R10.2 45.23,37.45 45.17,37.51 45.17,38.03 45.05,38.15 44.03,38.15 v1(43.9,38.28)
  Inner2 w0.254: v1(43.9,38.28) 43.9,40.44 U64.47
B12: length 90.2
  Top Layer w0.254: 56.9,64.15 57.67,63.38 61.32,63.38 62.02,64.08
  Inner2 w0.254: U64.29 68.41,40.06 68.41,53.01 62.06,59.36 v1(62.06,64.06)
  Bottom Layer w0.254: v1(12.15,38.03) 15.33,38.03 16.23,37.13 65.48,37.13 U64.29
B13: length 90
  Top Layer w0.254: 64.02,64.55 63.79,64.77 59.91,64.77 59.04,65.64
  Inner2 w0.254: 66.8,35.61 69.1,37.92 69.1,53.78 64.11,58.77 v1(64.11,64.62)
  Bottom Layer w0.254: U64.27 65.24,34.34 62.7,34.34 61.3,35.74 49.49,35.74 47.85,34.1 15.72,34.1 v1(15.71,34.09)
B14: length 69.7
  Top Layer w0.254: U64.30 64.73,38.15 66,39.42 67.53,39.42 68.29,40.19 68.29,52.89 69.56,54.16 v1(70.32,54.16)
  Bottom Layer w0.254: v1(70.32,54.16) 单驱连接.6 ; U64.30 58.64,38.15 56.6,40.19 38.32,40.19 37.68,39.55 19.39,39.55 v1(18.76,38.92)
B15: length 28.4
  Top Layer w0.254: U64.28 65.37,37.01 68.29,37.01 69.69,38.41 v1(69.69,52.63)
  Bottom Layer w0.254: v1(69.69,52.63) 67.27,55.55 单驱连接.2
B16: length 111.3
  Top Layer w0.254: 7.43,29.21 7.91,29.21 8.66,29.96 8.66,32.01 7.13,33.55 4.32,33.55 3.57,34.29 3.57,37.34 3.39,37.52 2.63,37.52 1.99,38.15 v1(1.99,39.42) ; 虚线串口spi.1 91.63,47.17 v1(89.8,47.17)
  Bottom Layer w0.254: 90,47.17 80.61,47.17 75.4,41.96 66.13,41.96 64.86,40.69 U64.32 62.46,42.21 17.73,42.21 14.69,39.17 6.95,39.17 5.8,40.31 2.88,40.31 v1(1.99,39.42)
B17: length 115.5
  Top Layer w0.254: v1(6.09,38.57) 5.55,38.03 5.55,34.49 6.07,33.96 7.33,33.96 9.09,32.2 9.09,26.61 11.44,24.26 12.97,24.26 14.82,22.41 14.82,19.99 13.75,18.93 CN11.3 ; 虚线串口spi.3 89.85,42.22 89.79,42.28
  Bottom Layer w0.254: v1(6.09,38.57) 6.13,38.61 15.79,38.61 19.02,41.85 60.91,41.85 63.34,39.42 65.24,39.42 U64.31 77.18,40.69 78.76,42.28 89.79,42.28
  vias: v1(89.75,42.22)
B18: length 100.6
  Top Layer w0.254: CN12.3 19.47,8.77 20.54,9.83 20.54,11.87 19.73,12.67 17.41,12.67 15.42,14.66 15.42,22.57 13.04,24.95 11.52,24.95 9.54,26.92 9.54,32.38 7.58,34.34 6.59,34.34 6.19,34.75 6.19,37.52 7.23,38.57 v1(7.23,40.09)
  Bottom Layer w0.254: v1(7.23,40.09) 11.89,44.75 62.46,44.75 U64.34
B19: length 60.1
  Bottom Layer w0.254: v1(9.74,39.88) 13.75,39.88 18.13,44.26 61.29,44.26 63.59,41.96 65.24,41.96 U64.33
B20: length 10.7
  Top Layer w0.254: 摄像头.15 64.73,53.27 65.24,52.76 65.24,47.04 U64.36
B21: length 48.3
  Bottom Layer w0.254: 23.93,53.96 27.89,46.8 37.54,46.8 38.95,45.39 62.7,45.39 63.59,44.5 65.24,44.5 U64.35
B22: length 19.6
  Top Layer w0.254: 摄像头.5 52.08,55.68 v1(53.3,55.68)
  Bottom Layer w0.254: U64.38 62.83,47.17 59.65,47.17 58.25,48.57 58.25,54.79 57.37,55.68 v1(53.3,55.68)
B23: length 54.7
  Bottom Layer w0.254: 27.81,62.49 27.27,61.27 30.31,55.81 30.31,54.12 v1(29.53,53.34) 29.53,48.8 29.04,48.31 29.04,47.68 29.45,47.27 38.21,47.27 38.7,46.79 63.34,46.79 63.59,47.04 65.24,47.04 U64.37
B24: length 30.5
  Top Layer w0.254: v1(46.95,63.43) 摄像头.2
  Bottom Layer w0.254: U64.40 63.97,62.16 62.7,63.43 v1(46.95,63.43)
B25: length 31.5
  Top Layer w0.254: v1(49.49,64.06) 摄像头.4
  Bottom Layer w0.254: U64.39 64.86,52.51 64.86,63.05 63.21,64.7 50.13,64.7 v1(49.49,64.06)
B26: length 20.3
  Top Layer w0.254: 摄像头.6 52.03,62.03 52.24,62.23 v1(53.31,62.23)
  Bottom Layer w0.254: U64.42 61.43,60.76 59.96,62.23 v1(53.31,62.23)
B27: length 20.9
  Top Layer w0.254: 摄像头.8 54.57,61.27 54.27,60.96 v1(53.33,60.96)
  Bottom Layer w0.254: U64.41 61.3,48.31 59.78,49.84 59.78,59.62 58.51,60.89 53.41,60.89 v1(53.33,60.96)
B28: length 31.5
  Top Layer w0.254: U64.46 33.49,55.3 38.32,60.13 56.86,60.13 57.11,60.38 摄像头.10
B29: length 32.7
  Top Layer w0.254: U64.45 36.03,56.7 38.82,59.49 59.4,59.49 59.65,59.74 摄像头.12
B30: length 36.3
  Top Layer w0.254: U64.43 41.36,48.06 48.48,48.06 50.28,49.87 50.28,57.74 51.4,58.86 61.43,58.86 62.19,59.62 摄像头.14
B31: length 39.5
  Top Layer w0.254: 摄像头.16 64.73,59.24 63.72,58.22 51.52,58.22 51.02,57.71 51.02,49.08 48.73,46.79 40.09,46.79 U64.44
C0: length 93.5
  Top Layer w0.254: v1(74.38,49.08) 74.38,14.15 73.24,13.01 69.3,13.01 68.41,12.12 68.41,7.8 66.94,6.33 34.68,6.33 U64.82
  Bottom Layer w0.254: v1(74.38,49.08) 74.26,53.14 76.42,56.82 单驱连接.7
C1: length 83.2
  Top Layer w0.254: v1(73.11,49.2) 73.11,14.79 72.22,13.9 68.67,13.9 67.65,12.88 67.65,9.71 66.89,8.94 63.34,8.94 61.07,6.68 37.02,6.68 U64.79
  Bottom Layer w0.254: v1(73.11,49.2) 73.87,55.23
C2: length 63.5
  Top Layer w0.254: U64.80 32.23,8.94 28.16,8.94 22.79,14.31 22.79,49.55 v1(28.03,54.79)
  Bottom Layer w0.254: 25.61,61.22 24.98,59.62 v1(28.03,54.79)
C3: length 59
  Top Layer w0.254: U64.77 34.76,11.48 30.19,11.48 24.98,16.69 24.98,48.36 v1(27.08,50.46)
  Bottom Layer w0.254: U58.5 22.82,58.35 25.74,53.39 v1(27.08,50.46)
C4: length 54
  Top Layer w0.254: U64.78 28.41,10.21 23.46,15.17 23.46,48.91 v1(27.25,52.7)
  Bottom Layer w0.254: v1(27.25,52.7) U58.6
C6: length 45.9
  Top Layer w0.254: U64.76 30.7,12.75 26.63,16.82 26.63,45.33 v1(26.44,45.52)
  Bottom Layer w0.254: v1(26.44,45.52) U58.2
C7: length 53
  Top Layer w0.254: v1(27.39,45.52) 27.39,18.6 31.97,14.02 34.76,14.02 U64.73
  Bottom Layer w0.254: v1(27.39,45.52) 20.66,57.08 U58.1
C8: length 50.3
  Top Layer w0.254: U64.74 31.71,15.29 29.3,17.71 29.3,48.43 28.2,49.53 28.2,51.02 29.6,52.43 v1(30.87,52.43)
  Bottom Layer w0.254: U58.12 33.62,58.15 33.62,55.17 v1(30.87,52.43)
C9: length 54.2
  Top Layer w0.254: U64.71 34.76,16.56 32.85,16.56 30.06,19.36 30.06,47.93 v1(29.88,48.11)
  Bottom Layer w0.254: U58.11 29.55,62.16 32.73,56.57 32.73,55.55 30.19,53.01 30.19,48.42 v1(29.88,48.11)
C10: length 19.8
  Top Layer w0.254: U64.72 32.09,19.23 32.09,26.09 32.73,26.72 37.17,26.72 37.68,27.23 37.68,28.5 38.39,29.21 38.82,29.21 39.02,29.4 39.02,31.29
C11: length 7.7
  Top Layer w0.254: U64.69 36.79,20.37 37.43,19.74 40.98,19.74 41.42,20.18 RN4.1 RN1.4
C12: length 7.8
  Top Layer w0.254: 39.02,22.01 39.02,20.64 37.8,20.64 36.79,21.64 34.76,21.64 U64.70
C13: length 5.8
  Top Layer w0.254: U64.67 36.25,22.69 39.59,22.69 39.84,22.44 39.84,22.03 RN1.2 RN4.3
C14: length 10.3
  Top Layer w0.254: RN4.2 RN1.3 40.62,22.61 40.09,23.14 37.84,23.14 36.79,24.18 34.76,24.18 U64.68
C15: length 10
  Top Layer w0.254: U64.65 36.66,25.45 36.69,25.48 37.07,25.48 38.04,26.45 38.04,28.25 38.64,28.85 40.98,28.85 41.42,29.29 RN2.1 RN3.8
C16: length 50.8
  Top Layer w0.254: 36.74,69.24 35.12,65.16 ; 35.86,66.81 35.83,66.79
  Inner2 w0.254: U64.66 30.82,28.12 30.82,51.49 33.24,53.9 36.29,53.9 37.46,55.06 37.46,62.99 v1(35.18,65.26)
C17: length 49.3
  Top Layer w0.254: 37.83,65.05 39.1,68.45
  Inner2 w0.254: U64.63 34.76,29.26 32.73,29.26 31.84,30.15 31.84,51.49 33.49,53.14 37.81,53.14 38.72,54.05 38.72,64.11 v1(37.82,65.01)
C18: length 27.8
  Top Layer w0.254: v1(21.17,27.87) 21.17,41.33 20.58,41.92 屏幕.16
  Bottom Layer w0.254: v1(21.17,27.87) 21.81,28.5 32.98,28.5 U64.64
C19: length 35.2
  Top Layer w0.254: v1(13.93,29.62) 13.93,39.17 14.82,40.06 屏幕.12
  Bottom Layer w0.254: U64.61 35,29.51 14.05,29.51 v1(13.93,29.62)
C20: length 29.4
  Bottom Layer w0.254: U64.62 33.15,30.88 14.99,30.88 14.19,31.68 陀螺仪.6
C21: length 32.8
  Bottom Layer w0.254: U64.59 35,32.05 15.22,32.05 13.04,34.22 陀螺仪.5
C22: length 30.5
  Bottom Layer w0.254: U64.60 33.06,33.51 15.02,33.51 11.77,36.76 陀螺仪.4
C23: length 33.9
  Bottom Layer w0.254: U64.57 35,34.59 17.37,34.59 14.57,37.39 6.44,37.39 陀螺仪.3
C24: length 23
  Top Layer w0.254: v1(28.78,50.38) 28.78,50.3 30.61,48.47 30.61,38.49 U64.58
  Bottom Layer w0.254: U58.8 28.78,56.04 v1(28.78,50.38)
C26: length 25.2
  Top Layer w0.254: RN2.2 RN3.7 40.6,31.3 40.6,31.93 40.86,32.19 42.38,32.19 42.89,32.69 42.89,40.82 41.87,41.84 35.27,41.84 34.76,41.33 34.76,39.42 U64.56
C27: length 13.3
  Top Layer w0.254: RN2.3 RN3.6 39.82,31.82 39.46,32.19 37.81,32.19 37.43,32.57 37.43,39.3 U64.53
C28: length 36.5
  Top Layer w0.254: 摄像头.9 57.24,55.6 57.24,45.14 54.31,42.21 34.62,42.21 33.49,41.08 U64.54
C29: length 38
  Top Layer w0.254: U64.51 37.05,44.25 54.7,44.25 55.84,45.39 55.84,57.08 56.35,57.59 59.27,57.59 59.65,57.2 摄像头.11
CR: length 29.7
  Top Layer w0.254: 45.91,23.31 46.81,23.31 47.08,23.04 47.08,17.45 46.64,17.01 U65.3 45.93,14.11 49.2,10.84 U71.4 49.88,10.84 51.8,12.75 56.1,12.75 57.49,11.36 C3.1 57.55,10.59 R2.2 R1.2
D2: length 54.8
  Top Layer w0.254: v1(75.91,51.36) 71.46,51.36 71.21,51.11 71.21,18.09 69.69,16.56 65.24,16.56 U64.12
  Bottom Layer w0.254: v1(75.91,51.36) 79.72,57.59 单驱连接.11
D3: length 47.1
  Top Layer w0.254: U64.11 70.7,15.29 71.84,16.44 71.84,49.71 72.48,50.35 v1(76.92,50.35)
  Bottom Layer w0.254: v1(76.92,50.35) 单驱连接.12
D12: length 45.4
  Top Layer w0.254: v1(96.23,39.68) 虚线串口spi.7
  Bottom Layer w0.254: U64.15 87.59,20.37 96.23,29.01 v1(96.23,39.68)
D13: length 48.8
  Top Layer w0.254: v1(95.21,39.68) 虚线串口spi.4
  Bottom Layer w0.254: v1(95.21,39.68) 95.21,29.26 87.83,21.89 65.48,21.89 U64.16
D14: length 45.2
  Top Layer w0.254: 虚线串口spi.8 97.53,42.09 v1(94.32,42.09)
  Bottom Layer w0.254: U64.17 66.56,22.97 85.48,22.97 94.32,31.8 v1(94.32,42.09)
D15: length 42.6
  Top Layer w0.254: v1(93.31,37.14) 虚线串口spi.6
  Bottom Layer w0.254: v1(93.31,37.14) 93.31,31.93 85.8,24.43 65.48,24.43 U64.18
D16: length 30.3
  Top Layer w0.254: v1(82.54,38.66) 80.86,38.66 无线串口.1
  Bottom Layer w0.254: U64.19 67.02,24.95 79.46,24.95 82.54,28.03 v1(82.54,38.66)
D17: length 30.1
  Top Layer w0.254: v1(81.75,37.27) 83.4,37.27 无线串口.3
  Bottom Layer w0.254: U64.20 64.22,25.45 65.25,26.48 79.35,26.48 81.75,28.88 v1(81.75,37.27)
D26: length 83.7
  Top Layer w0.254: 无线串口.4 83.4,41.77 81.75,40.12 v1(81.75,39.81)
  Bottom Layer w0.254: U64.84 34.76,3.86 36.92,3.86 38.7,5.64 38.7,24.44 41.22,26.97 77.8,26.97 80.48,29.65 80.48,38.54 v1(81.75,39.81)
D27: length 87.3
  Top Layer w0.254: R9.1 88.48,45.53 无线串口.8 88.48,41.2 v1(88.1,40.82)
  Bottom Layer w0.254: v1(88.1,40.82) 81.24,40.82 79.59,39.17 79.59,31.17 77.44,29.02 63.47,29.02 62.19,27.74 40.98,27.74 37.68,24.44 37.68,6.79 U64.81
$1N21001: length 2.3
  Top Layer w0.254: R3.2 摄像头.7
$3N1397: length 9.4
  Top Layer w0.254: R2.1 R1.1 61.95,9.08 62.45,9.58 62.45,10.72 63.27,11.55 65.3,11.55 U64.9
$3N1900: length 4.6
  Top Layer w0.254: U71.3 52.3,10.84 52.79,10.34 52.79,10.09 53.05,9.83 54.83,9.83 R8.2
$3N2786: length 7.2
  Top Layer w0.254: R12.2 53.99,35.1 BUZZER1.1
$3N2792: length 6.4
  Top Layer w0.254: Q1.3 54.74,38.15 BUZZER1.2
$3N2800: length 2.1
  Top Layer w0.254: R10.1 47.03,38.91 Q1.1
$3N3682: length 65.4
  Top Layer w0.254: v1(69.42,30.6) 68.09,29.26 45.85,29.26 v1(44.97,28.39) ; v1(39.02,35.17) 39.02,33.09 ; v1(78.07,31.21) 78.11,31.17 83.02,31.17 84.54,32.69 SW3.4 88.09,34.35 89.93,32.52 U72.1
  Inner2 w0.254: v1(44.97,28.39) 43.85,29.52 40.09,29.52 39.02,30.59 v1(39.02,35.17)
  Bottom Layer w0.254: 78.19,31.17 77.62,30.6 v1(69.42,30.6)
$3N3687: length 50.8
  Top Layer w0.254: v1(78.07,32.31) 81.62,32.31 82,32.69 SW3.5 ; v1(69.41,31.71) 69.12,31.42 67.78,31.42 67.51,31.69 62.08,31.69 61.41,31.03 v1(44.73,31.03) ; v1(39.82,35.2) RN3.3
  Inner2 w0.254: v1(44.73,31.03) 44.62,30.92 40.47,30.92 39.82,31.57 v1(39.82,35.2)
  Bottom Layer w0.254: v1(69.41,31.71) 77.47,31.71 v1(78.07,32.31)
$3N3693: length 44.2
  Top Layer w0.254: v1(69.43,32.75) 68.73,32.05 45.11,32.05 v1(44.7,32.46) ; v1(40.62,35.19) 40.62,33.09 RN3.2 ; SW3.6 78.71,34.35 v1(78.07,33.71)
  Inner2 w0.254: v1(44.7,32.46) 44.67,32.49 44.67,34.22 43.7,35.19 v1(40.62,35.19)
  Bottom Layer w0.254: v1(78.07,33.71) 77.1,32.75 v1(69.43,32.75)
$3N3700: length 70.3
  Top Layer w0.254: v1(43.78,33.33) 43.78,26.72 42.13,25.07 42.13,13 v1(42.63,12.5) ; SW5.6 82.57,3.3 v1(82.55,3.28) ; v1(42.18,33.09) RN3.1
  Bottom Layer w0.254: v1(42.63,12.5) 42.63,11.11 49.64,4.09 81.74,4.09 v1(82.55,3.28) ; v1(43.78,33.33) 42.43,33.33 v1(42.18,33.09)
$3N3710: length 41.9
  Top Layer w0.254: v1(70.28,2.9) 70.28,4.8 SW5.3 ; v1(41.49,12.63) 41.42,12.7 RN4.8
  Bottom Layer w0.254: v1(41.49,12.63) 41.49,11.1 48.86,3.74 69.44,3.74 v1(70.28,2.9)
$3N3730: length 51.4
  Top Layer w0.254: v1(40.6,15.1) 40.86,15.35 40.86,17.95 40.62,18.19 RN4.7 ; SW5.5 82.57,6.87 v1(82.55,6.85)
  Bottom Layer w0.254: v1(40.6,15.1) 41.18,15.1 50,6.28 81.97,6.28 v1(82.55,6.85)
$3N3739: length 49.1
  Top Layer w0.254: SW5.4 82.57,9.92 v1(82.55,9.91) ; RN4.6 39.82,17.98 40.09,17.71 v1(40.09,17.58)
  Bottom Layer w0.254: v1(82.55,9.91) 81.71,9.07 49.75,9.07 41.24,17.58 v1(40.09,17.58)
$3N3749: length 39.2
  Top Layer w0.254: 39.02,18.84 39.02,17.84 v1(39.28,17.58) ; v1(70.28,7.07) 70.28,8.48 SW5.2
  Bottom Layer w0.254: v1(70.28,7.07) 69.84,6.63 50.47,6.63 41.3,15.8 39.84,15.8 39.28,16.36 v1(39.28,17.58)
$4N2636: length 1.5
  Top Layer w0.254: R5.1 92.33,24.61 92.37,24.57
$4N2685: length 1.5
  Top Layer w0.254: R4.1 91.38,22.83 LED2.2
$4N2734: length 1.5
  Top Layer w0.254: R6.1 90.37,21.06 LED3.2
$4N2783: length 1.5
  Top Layer w0.254: LED4.2 89.35,19.28 R7.1

## Copper pours and planes (outline as drawn; the poured copper is in the pictures)
GND_MAIN on Top Layer: -5.37,80.32 106.01,80.32 106.01,-4.9 -5.37,-4.9
GND_MAIN on Bottom Layer: -4.99,79.68 105.63,79.68 105.63,-9.22 -4.99,-9.22
GND_MAIN on Inner1: 0.25,76.52 99.75,76.52 99.75,0.27 0.25,0.27
GND_MAIN on Inner2: -4.99,80.38 106.77,80.38 106.77,-9.85 -4.99,-9.85
VCC_5V_EXT on Top Layer: 51.14,7.82 52.05,6.91 53.94,6.91 54.57,7.55 54.57,9.33 54.32,9.33 54.09,9.55 51.36,9.55 51.14,9.34
VCC_5V_EXT on Inner2: 51.27,7.66 51.91,7.03 51.92,7.03 52.03,6.91 53.5,6.91 54.26,7.67 54.26,8.51 54.32,8.56 53.43,8.56 53.3,8.69 51.27,8.69

Small or netless copper shapes (teardrops, artwork), in the pictures only: 32 on Inner1

## Text on the board
Bottom Silkscreen Layer: B15 BATAD | GND | B14 IA1 | VCC | C1 DIR1 | C0 STL1 | D3 EN1 | D2 PH1 | C7 PH3 | C6 EN3 | C3 STL3 | B21 IADC3 | C2 STL2 | C4 DIR3 | B23 IA2 | C24 DIR2 | C9 PH2 | C8 EN2 | C21 | C20 | C23 | C22 | IMU | JLCJLCJLC | Designed By / SongJC | Ver 1.1
Top Layer: 华侨大学 / 鹭岛躺赢狗 / 25.3.16
Top Silkscreen Layer: C12 | M C11 | C13 | C15 | C26 | C27 | C14 | 3VC | C10 | 3V3 | 5V | 5VE | G | V | B16 | B17 | B18 | B12 | B13 | C16 | C17 | B9 | B10 | + | -
